# Altium schematic sheet MICROCONTROLLER.SchDoc
size A; SheetNumber: 1; SheetTotal: 6
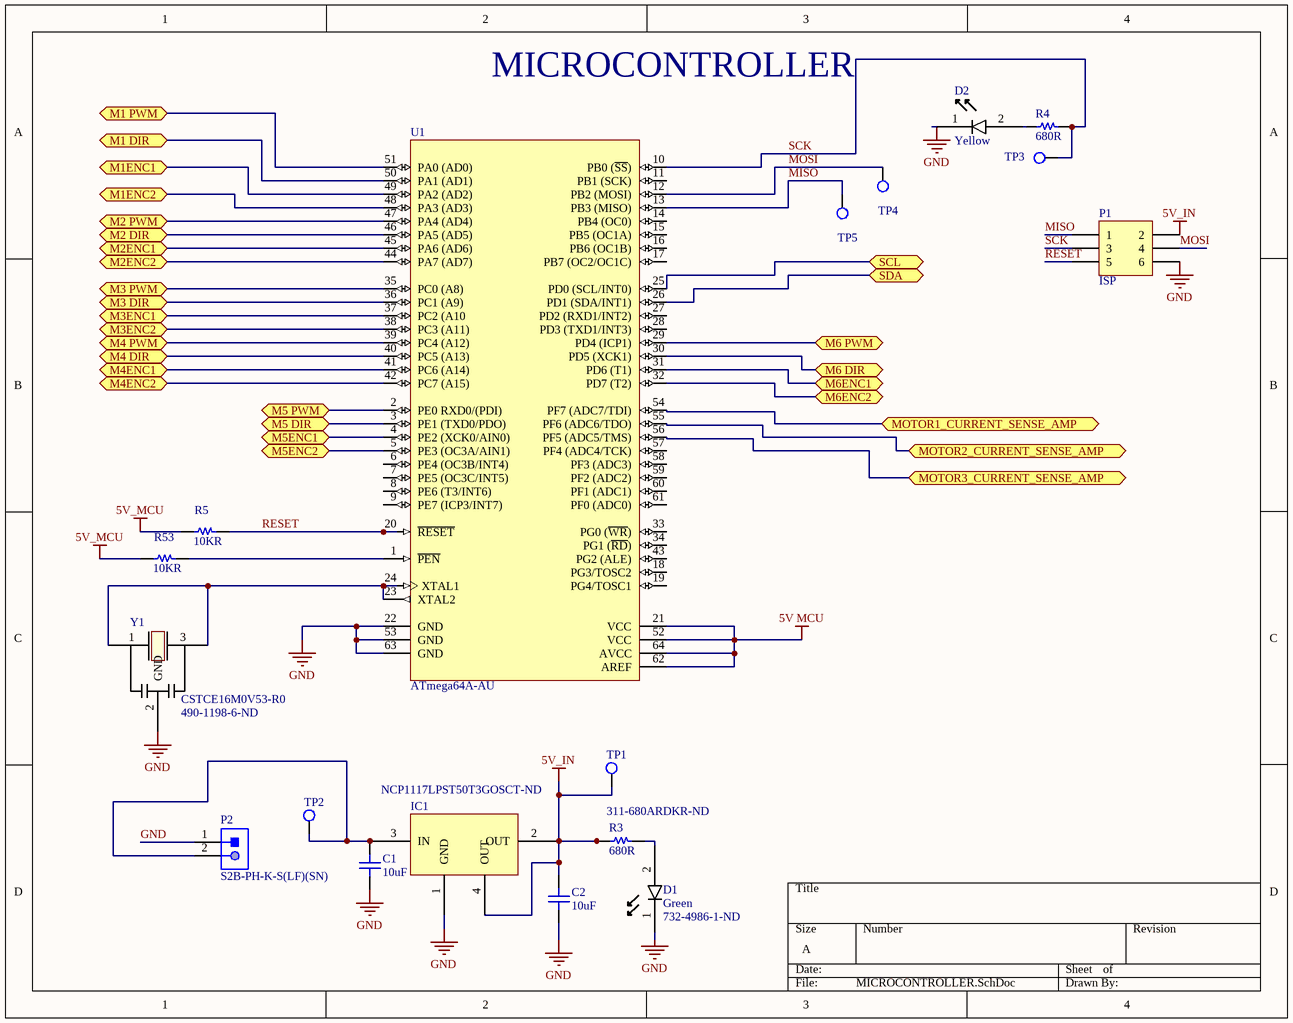
[diagram p0: MICROCONTROLLER.SchDoc]

## Parts
C1  10uF  [CAP_ADJ_0805]
C2  10uF  [CAP_ADJ_0805]
D1  Green  Supplier Part Number 1: 732-4986-1-ND  [LED_150080VS75000]
D2  Yellow  [LED_150080VS75000]
IC1  NCP1117LPST50T3GOSCT-ND  [NCP1117LPST50T3GOSCT-ND]
P1  ISP  [HDR2X3]
P2  S2B-PH-K-S(LF)(SN)  [JST-S2B-PH-K-S_V]
R3  680R  Supplier Part Number 1: 311-680ARDKR-ND  [RES_ADJ_0805_YAGEO]
R4  680R  [RES_ADJ_0805_YAGEO]
R5  10KR  [RES_ADJ_0805_YAGEO]
R53  10KR  [RES_ADJ_0805_YAGEO]
TP1  TEST_POINT  [TEST_POINT]  (value not drawn)
TP2  TEST_POINT  [TEST_POINT]  (value not drawn)
TP3  TEST_POINT  [TEST_POINT]  (value not drawn)
TP4  TEST_POINT  [TEST_POINT]  (value not drawn)
TP5  TEST_POINT  [TEST_POINT]  (value not drawn)
U1  ATmega64A-AU  [64A_M]
Y1  CSTCE16M0V53-R0  Supplier Part Number 1: 490-1198-6-ND  [CSTCE16M0V53-R0]

## Ports
M1 DIR (bidir), M1 PWM (bidir), M1ENC1 (bidir), M1ENC2 (bidir), M2 DIR (bidir), M2 PWM (bidir), M2ENC1 (bidir), M2ENC2 (bidir), M3 DIR (bidir), M3 PWM (bidir), M3ENC1 (bidir), M3ENC2 (bidir), M4 DIR (bidir), M4 PWM (bidir), M4ENC1 (bidir), M4ENC2 (bidir), M5 DIR (bidir), M5 PWM (bidir), M5ENC1 (bidir), M5ENC2 (bidir), M6 DIR (bidir), M6 PWM (bidir), M6ENC1 (bidir), M6ENC2 (bidir), MOTOR1_CURRENT_SENSE_AMP (bidir), MOTOR2_CURRENT_SENSE_AMP (bidir), MOTOR3_CURRENT_SENSE_AMP (bidir), SCL (bidir), SDA (bidir)

## Nets
5V MCU: U1.21(VCC) U1.52(VCC) U1.62(AREF) U1.64(AVCC)
5V_IN: C2.2 IC1.2(OUT) IC1.4(OUT) P1.2 R3.1 TP1.1
5V_MCU: R5.1 R53.1
GND: C1.1 C2.1 D1.1 D2.1 IC1.1(GND) P1.6 P2.1 U1.22(GND) U1.53(GND) U1.63(GND) Y1.2(GND)
M1 DIR: U1.50(PA1_(AD1)) ; port M1 DIR
M1 PWM: U1.51(PA0_(AD0)) ; port M1 PWM
M1ENC1: U1.49(PA2_(AD2)) ; port M1ENC1
M1ENC2: U1.48(PA3_(AD3)) ; port M1ENC2
M2 DIR: U1.46(PA5_(AD5)) ; port M2 DIR
M2 PWM: U1.47(PA4_(AD4)) ; port M2 PWM
M2ENC1: U1.45(PA6_(AD6)) ; port M2ENC1
M2ENC2: U1.44(PA7_(AD7)) ; port M2ENC2
M3 DIR: U1.36(PC1_(A9)) ; port M3 DIR
M3 PWM: U1.35(PC0_(A8)) ; port M3 PWM
M3ENC1: U1.37(PC2_(A10) ; port M3ENC1
M3ENC2: U1.38(PC3_(A11)) ; port M3ENC2
M4 DIR: U1.40(PC5_(A13)) ; port M4 DIR
M4 PWM: U1.39(PC4_(A12)) ; port M4 PWM
M4ENC1: U1.41(PC6_(A14)) ; port M4ENC1
M4ENC2: U1.42(PC7_(A15)) ; port M4ENC2
M5 DIR: U1.3(PE1_(TXD0/PDO)) ; port M5 DIR
M5 PWM: U1.2(PE0_RXD0/(PDI)) ; port M5 PWM
M5ENC1: U1.4(PE2_(XCK0/AIN0)) ; port M5ENC1
M5ENC2: U1.5(PE3_(OC3A/AIN1)) ; port M5ENC2
M6 DIR: U1.30(PD5_(XCK1)) ; port M6 DIR
M6 PWM: U1.29(PD4_(ICP1)) ; port M6 PWM
M6ENC1: U1.31(PD6_(T1)) ; port M6ENC1
M6ENC2: U1.32(PD7_(T2)) ; port M6ENC2
MISO: P1.1 TP5.1 U1.13(PB3_(MISO))
MOSI: P1.4 TP4.1 U1.12(PB2_(MOSI))
MOTOR1_CURRENT_SENSE_AMP: U1.54(PF7_(ADC7/TDI)) ; port MOTOR1_CURRENT_SENSE_AMP
MOTOR2_CURRENT_SENSE_AMP: U1.55(PF6_(ADC6/TDO)) ; port MOTOR2_CURRENT_SENSE_AMP
MOTOR3_CURRENT_SENSE_AMP: U1.56(PF5_(ADC5/TMS)) ; port MOTOR3_CURRENT_SENSE_AMP
RESET: P1.5 R5.2 U1.20(~{RESET})
SCK: P1.3 R4.2 TP3.1 U1.10(PB0_(~{SS}))
SCL: U1.25(PD0_(SCL/INT0)) ; port SCL
SDA: U1.26(PD1_(SDA/INT1)) ; port SDA
NetC1_2: C1.2 IC1.3(IN) P2.2 TP2.1
NetD1_2: D1.2 R3.2
NetD2_2: D2.2 R4.1
NetR53_2: R53.2 U1.1(~{PEN})
NetU1_23: U1.23(XTAL2) U1.24(XTAL1) Y1.1 Y1.3

Not connected (* = marked no-connect by the designer): U1 6(PE4_(OC3B/INT4)) 7(PE5_(OC3C/INT5)) 8(PE6_(T3/INT6)) 9(PE7_(ICP3/INT7)) 11(PB1_(SCK)) 14(PB4_(OC0)) 15(PB5_(OC1A)) 16(PB6_(OC1B)) 17(PB7_(OC2/OC1C)) 18(PG3/TOSC2) 19(PG4/TOSC1) 27(PD2_(RXD1/INT2)) 28(PD3_(TXD1/INT3)) 33(PG0_(~{WR})) 34(PG1_(~{RD})) 43(PG2_(ALE)) 57(PF4_(ADC4/TCK)) 58(PF3_(ADC3)) 59(PF2_(ADC2)) 60(PF1_(ADC1)) 61(PF0_(ADC0))

## Notes on the sheet
- MICROCONTROLLER

## Library data of the parts
C1 C2 = CAP_ADJ_0805: CERAMIC CAPACITOR SMD 0805; Manufacturer: Taiyo Yuden; Manufacturer Part Number: TMK212BBJ106KG-T; Voltage Rating: 25V; Tolerance: 10%; Dielectric: X7R; Voltage: 16V; Supplier 1: Digi-Key; Supplier Part Number 1: 587-2985-1-ND; Stock 1: 268572; Pricing 1: 1=0.19, 10=0.132, 100=0.0668, 500=0.0457, 1000=0.0404 (USD); Mount: Surface Mount; Case/Package: 0805; Number of Pins: 2; Case Code (Metric): 2012; Case Code (Imperial): 0805; Min Operating Temperature: -55°C; Max Operating Temperature: 85°C; Package Quantity: 1; Capacitance: 10uF; Packaging: Tape and Reel; Voltage Rating (DC): 25V; Termination: SMD/SMT; Composition: Ceramic; Length: 0.079inch; Height: 1.25mm; Width: 0.049inch; Thickness: 0.053inch; REACH SVHC: No SVHC; Lead Free: Lead Free; ComponentLink1URL: https://datasheet.ciiva.com/139/mlcc-all-e-139570.pdf; ComponentLink1Description: https://datasheet.ciiva.com/139/mlcc-all-e-139570.pdf; ComponentLink2URL: https://datasheet.ciiva.com/139/mlcc-all-e-139571.pdf; ComponentLink2Description: https://datasheet.ciiva.com/139/mlcc-all-e-139571.pdf; ComponentLink3URL: https://datasheet.ciiva.com/30062/tmk212bbj106kg-t-30062083.pdf; ComponentLink3Description: https://datasheet.ciiva.com/30062/tmk212bbj106kg-t-30062083.pdf; ComponentLink4URL: https://datasheet.ciiva.com/139/mlcc-all-e-139572.pdf; ComponentLink4Description: https://datasheet.ciiva.com/139/mlcc-all-e-139572.pdf; ComponentLink5URL: https://datasheet.ciiva.com/7975/1481447-7975820.pdf; ComponentLink5Description: https://datasheet.ciiva.com/7975/1481447-7975820.pdf
D1 = LED_GRN_150080VS75000: LED GREEN CLEAR 0805 SMD; Manufacturer: Wurth Electronics; Luminous Intensity: 40mcd; Forward Current: 30mA; Forward Voltage: 2V; Viewing Angle: 140°; Wavelength: 570nm; Lens Style: Clear,Rectangular; Test Current: 20mA; Supplier 1: Digi-Key; Manufacturer Part Number: 150080VS75000; Stock 1: 6059; Pricing 1: 1=0.17, 50=0.16, 100=0.137, 500=0.118 (USD); Case/Package: 0805; Colour: Green; Case Code (Metric): 2012; Case Code (Imperial): 0805; Min Operating Temperature: -40°C; Max Operating Temperature: 85°C; Package Quantity: 4000; Packaging: Tape and Reel; Dominant Wavelength: 570nm; Length: 2mm; Height: 0.7mm; Width: 1.25mm; REACH SVHC: Unknown; ComponentLink1URL: https://datasheet.ciiva.com/22656/150080vs75000-22656966.pdf; ComponentLink1Description: https://datasheet.ciiva.com/22656/150080vs75000-22656966.pdf; ComponentLink2URL: https://datasheet.ciiva.com/29563/150080vs75000-29563018.pdf; ComponentLink2Description: https://datasheet.ciiva.com/29563/150080vs75000-29563018.pdf; ComponentLink3URL: https://datasheet.ciiva.com/29279/759437-da-01-en-chipled-0805-w-kl-h-gruen-150080vs7500-29279047.pdf; ComponentLink3Description: https://datasheet.ciiva.com/29279/759437-da-01-en-chipled-0805-w-kl-h-gruen-150080vs7500-29279047.pdf
D2 = LED_YLW_150080YS75000: LED YELLOW CLEAR 0805 SMD; Manufacturer: Wurth Electronics; Luminous Intensity: 120mcd; Forward Current: 30mA; Forward Voltage: 2V; Viewing Angle: 140°; Wavelength: 590nm; Lens Style: Clear,Rectangular; Test Current: 20mA; Supplier 1: Digi-Key; Manufacturer Part Number: 150080YS75000; Stock 1: 1178; Pricing 1: 1=0.17, 50=0.16, 100=0.137, 500=0.118 (USD); Case/Package: 0805; Colour: Yellow; Case Code (Metric): 2012; Case Code (Imperial): 0805; Min Operating Temperature: -40°C; Max Operating Temperature: 85°C; Package Quantity: 4000; Packaging: Tape and Reel; Dominant Wavelength: 590nm; Length: 2mm; Height: 0.7mm; Width: 1.25mm; REACH SVHC: Unknown; ComponentLink1URL: https://datasheet.ciiva.com/23843/150080ys75000-23843256.pdf; ComponentLink1Description: https://datasheet.ciiva.com/23843/150080ys75000-23843256.pdf; ComponentLink2URL: https://datasheet.ciiva.com/22656/1911353-22656971.pdf; ComponentLink2Description: https://datasheet.ciiva.com/22656/1911353-22656971.pdf; ComponentLink3URL: https://datasheet.ciiva.com/29563/150080ys75000-29563019.pdf; ComponentLink3Description: https://datasheet.ciiva.com/29563/150080ys75000-29563019.pdf; ComponentLink4URL: https://datasheet.ciiva.com/29563/150080ys75000-29563020.pdf; ComponentLink4Description: https://datasheet.ciiva.com/29563/150080ys75000-29563020.pdf; ComponentLink5URL: https://datasheet.ciiva.com/29563/150080ys75000-29563021.pdf; ComponentLink5Description: https://datasheet.ciiva.com/29563/150080ys75000-29563021.pdf; ComponentLink6URL: https://datasheet.ciiva.com/29279/759438-da-01-en-chipled-0805-w-kl-gelb-150080ys75000-29279034.pdf; ComponentLink6Description: https://datasheet.ciiva.com/29279/759438-da-01-en-chipled-0805-w-kl-gelb-150080ys75000-29279034.pdf; Supplier Part Number 1: 732-4987-1-ND
IC1 = NCP1117LPST50T3GOSCT-ND: IC REG LINEAR 5V 1A SOT223-4; Manufacturer: ON Semiconductor; Max Input Voltage: 18V; Min Input Voltage: -300mV; Number of Outputs: 1; Dropout Voltage: 1.3V; Min Current Limit: 1.1A; Polarity: Positive; Quiescent Current: 700uA; Supplier 1: Digi-Key; Manufacturer Part Number: NCP1117LPST50T3G; Stock 1: 18977; Pricing 1: 1=0.43, 10=0.351, 100=0.239, 500=0.1792, 1000=0.1344 (USD); Mount: Surface Mount; Case/Package: SOT-223; Number of Pins: 3; Contact Plating: Tin,Matte; Min Operating Temperature: 0°C; Max Operating Temperature: 125°C; Output Voltage: 5V; Max Output Current: 1A; Package Quantity: 4000; Packaging: Tape and Reel; Output Current: 1A; Number of Regulators: 1; Min Output Voltage: 5V; Nominal Output Voltage: 5V; Length: 6.7mm; Height: 1.69mm; Width: 3.7mm; REACH SVHC: No SVHC; Lead Free: Lead Free; Halogen Free: Halogen Free; ComponentLink1URL: https://datasheet.ciiva.com/16209/ncp1117lp-d-16209559.pdf; ComponentLink1Description: https://datasheet.ciiva.com/16209/ncp1117lp-d-16209559.pdf; ComponentLink2URL: https://datasheet.ciiva.com/13013/ncp1117lp-d-82673-13013019.pdf; ComponentLink2Description: https://datasheet.ciiva.com/13013/ncp1117lp-d-82673-13013019.pdf; ComponentLink3URL: https://datasheet.ciiva.com/8231/ncp1117lp-d-8231038.pdf; ComponentLink3Description: https://datasheet.ciiva.com/8231/ncp1117lp-d-8231038.pdf; ComponentLink4URL: https://datasheet.ciiva.com/30477/0900766b8124f872-30477007.pdf; ComponentLink4Description: https://datasheet.ciiva.com/30477/0900766b8124f872-30477007.pdf; Supplier Part Number 1: NCP1117LPST50T3GOSCT-ND
P1 = Header 3X2: Header, 3-Pin, Dual row; LatestRevisionDate: 17-Jul-2002; LatestRevisionNote: Re-released for DXP Platform.; Publisher: Altium Limited
P2 = CMP-1755-00004-1: Male Header, Pitch 2 mm, 1 x 2 Position, Height 4.8 mm, Tail Length 3.4 mm, -25 to 85 degC, RoHS, Bulk; Case\Package: Radial; Tolerance: 20%; Capacitance: 10 uF; Voltage Rating (DC): 50 V; Packaging: Bulk; ComponentLink1URL: http://www.jst-mfg.com/product/pdf/eng/ePH.pdf; Radiation Hardening: No; Height: 11 mm; Package Quantity: 200; PackageDescription: Male Header, Pitch 2 mm, 1 x 2 Position, Height 4.8 mm, Tail Length 3.4 mm; PackageReference: S2B-PH-K-S; Diameter: 5 mm; Pins: 2; Mount: Through Hole; Max Operating Temperature: 85 degC; Min Operating Temperature: -40 degC; ComponentLink1Description: Datasheet; DatasheetVersion: Dec-12; Length: 11 mm; Lead Pitch: 2 mm; REACH SVHC: No SVHC; Voltage Rating: 50 V; RoHSCompliant: true
R3 R4 = RES_ADJ_0805: RESISTOR 0805 YAGEO; Manufacturer Part Number: RC0805JR-07680RL; Power Rating: 125mW; Tolerance: 5%; Voltage Rating: 150V; Temperature Coefficient: 100ppm/°C; Value: *; Supplier 1: Digi-Key; Manufacturer: Yageo; Stock 1: 209478; Pricing 1: 1=0.1, 10=0.019, 100=0.0076, 1000=0.0034, 2500=0.003 (USD); Case/Package: 0805; Case Code (Imperial): 0805; Case Code (Metric): 2012; Contact Plating: Tin,Lead,Matte; Min Operating Temperature: -55°C; Max Operating Temperature: 155°C; Resistance: 680R; Packaging: Tape and Reel; Package Quantity: 5000; Composition: Thick Film; Termination: SMD/SMT; Military Standard: Not; Length: 2mm; Height: 0.5mm; Width: 1.25mm; Depth: 1.25mm; Radiation Hardening: No; REACH SVHC: Unknown; Lead Free: Lead Free; ComponentLink1URL: https://datasheet.ciiva.com/7941/442941-7941989.pdf; ComponentLink1Description: https://datasheet.ciiva.com/7941/442941-7941989.pdf; ComponentLink2URL: https://datasheet.ciiva.com/7941/442941-7941990.pdf; ComponentLink2Description: https://datasheet.ciiva.com/7941/442941-7941990.pdf
  R4: Supplier Part Number 1: 311-680ARDKR-ND
R5 R53 = RES_ADJ_0805: RESISTOR 0805 YAGEO; Manufacturer Part Number: RC0805JR-0710KL; Tolerance: 5%; Temperature Coefficient: 100ppm/°C; Power Rating: 125mW; Voltage Rating: 150V; Value: *; Supplier 1: Digi-Key; Supplier Part Number 1: 311-10KARDKR-ND; Manufacturer: Yageo; Stock 1: 1589050; Pricing 1: 1=0.1, 10=0.019, 100=0.0076, 1000=0.0034, 2500=0.003 (USD); Case/Package: 0805; Contact Plating: Tin,Matte; Case Code (Imperial): 0805; Case Code (Metric): 2012; Min Operating Temperature: -55°C; Max Operating Temperature: 155°C; Resistance: 10KR; Packaging: Tape and Reel; Composition: Thick Film; Termination: SMD/SMT; Military Standard: Not; Length: 2mm; Height: 0.5mm; Width: 1.25mm; Depth: 1.25mm; Radiation Hardening: No; REACH SVHC: Unknown; Lead Free: Lead Free; ComponentLink1URL: https://datasheet.ciiva.com/7983/444164-7983765.pdf; ComponentLink1Description: https://datasheet.ciiva.com/7983/444164-7983765.pdf; ComponentLink2URL: https://datasheet.ciiva.com/7941/444164-7941870.pdf; ComponentLink2Description: https://datasheet.ciiva.com/7941/444164-7941870.pdf; ComponentLink3URL: https://datasheet.ciiva.com/7941/444164-7941871.pdf; ComponentLink3Description: https://datasheet.ciiva.com/7941/444164-7941871.pdf
TP1-TP5 = TEST_POINT: TEST POINT PAD
U1 = CMP-0095-00307-2: 8-bit AVR Microcontroller, 2.7-5.5V, 16MHz, 64KB Flash, 2KB EEPROM, 4KB SRAM, 64-pin TQFP, Industrial Grade (-40°C to 85°C); ComponentLink1URL: http://www.atmel.com/; ComponentLink3Description: ATmega64A Summary; RevisionNote: DatasheetVersion updated. URLs added.; ComponentLink3URL: http://www.atmel.com/dyn/resources/prod_documents/8160S.pdf; ComponentLink1Description: Manufacturer URL; ComponentLink2URL: http://www.atmel.com/dyn/resources/prod_documents/doc8160.pdf; PackageVersion: revC, Oct-2010; DatasheetVersion: revC, Jul-2009; Code_JEDEC: MS-026-AEB; PackageDescription: 64-Pin Plastic Thin Profile Quad Flat Pack, 14 x 14 x 1.0 mm Body, 0.8 mm Pitch (TQFP); ComponentLink2Description: ATmega64A Datasheet; PackageReference: 64A
Y1 = CSTCE16M0V53-R0: CER RES 16.0000MHZ 15PF SMD; Manufacturer: Murata; Frequency: 16MHz; Frequency Tolerance: 0.5%; Impedance: 40R; Frequency Stability: 0.3%; Supplier 1: Digi-Key; Manufacturer Part Number: CSTCE16M0V53-R0; Stock 1: 103535; Pricing 1: 1=0.5, 10=0.42, 50=0.3776, 100=0.3357, 500=0.3189, 1000=0.2686 (USD); Case/Package: SMD/SMT; Number of Pins: 3; Contact Plating: Gold; Min Operating Temperature: -20°C; Max Operating Temperature: 80°C; Self Resonant Frequency: 16MHz; Load Capacitance: 15pF; Tolerance: 0.5%; Package Quantity: 3000; Capacitance: 15pF; Packaging: Tape and Reel; Termination: SMD/SMT; Composition: Ceramic; Length: 0.126inch; Height: 0.039inch; Width: 0.051inch; REACH SVHC: No SVHC; Lead Free: Lead Free; ComponentLink1URL: https://datasheet.ciiva.com/18183/getdatasheetpartid-152969-18183272.pdf; ComponentLink1Description: https://datasheet.ciiva.com/18183/getdatasheetpartid-152969-18183272.pdf; ComponentLink2URL: https://datasheet.ciiva.com/884/p16e-884477.pdf; ComponentLink2Description: https://datasheet.ciiva.com/884/p16e-884477.pdf; ComponentLink3URL: https://datasheet.ciiva.com/1361/1506176-1361293.pdf; ComponentLink3Description: https://datasheet.ciiva.com/1361/1506176-1361293.pdf; ComponentLink4URL: https://datasheet.ciiva.com/884/p16e-884478.pdf; ComponentLink4Description: https://datasheet.ciiva.com/884/p16e-884478.pdf; ComponentLink5URL: https://datasheet.ciiva.com/884/p16e-884479.pdf; ComponentLink5Description: https://datasheet.ciiva.com/884/p16e-884479.pdf; ComponentLink6URL: https://datasheet.ciiva.com/14132/ceralock-eng-bro-14132735.pdf; ComponentLink6Description: https://datasheet.ciiva.com/14132/ceralock-eng-bro-14132735.pdf; ComponentLink7URL: https://datasheet.ciiva.com/16216/l0430e-16216847.pdf; ComponentLink7Description: https://datasheet.ciiva.com/16216/l0430e-16216847.pdf